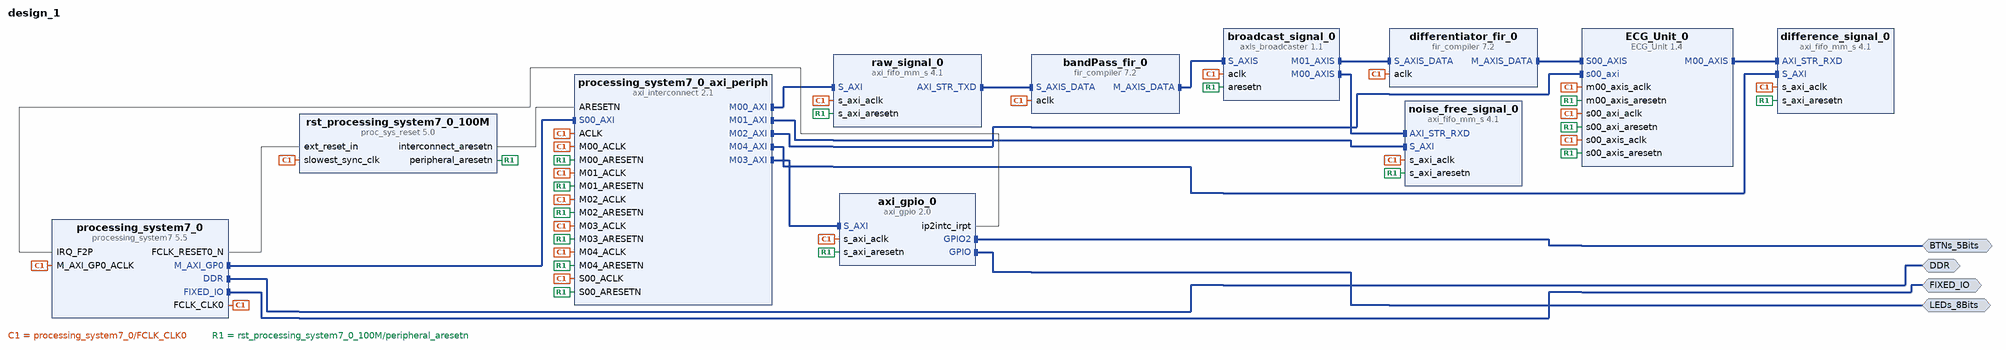
[diagram p0: block diagram of the top level]
# Vivado block design design_1, Vivado 2014.4
create_bd_design design_1

create_bd_intf_port -mode Master -vlnv xilinx.com:interface:gpio_rtl:1.0 BTNs_5Bits
create_bd_intf_port -mode Master -vlnv xilinx.com:interface:ddrx_rtl:1.0 DDR
create_bd_intf_port -mode Master -vlnv xilinx.com:display_processing_system7:fixedio_rtl:1.0 FIXED_IO
create_bd_intf_port -mode Master -vlnv xilinx.com:interface:gpio_rtl:1.0 LEDs_8Bits

create_bd_cell -type ip -vlnv xilinx.com:ip:axi_gpio:2.0 axi_gpio_0
set_property -dict [list \
  CONFIG.C_INTERRUPT_PRESENT 1 \
  CONFIG.USE_BOARD_FLOW true \
  CONFIG.GPIO_BOARD_INTERFACE LEDs_8Bits \
  CONFIG.GPIO2_BOARD_INTERFACE BTNs_5Bits \
] [get_bd_cells axi_gpio_0]
create_bd_cell -type ip -vlnv xilinx.com:ip:fir_compiler:7.2 bandPass_fir_0
set_property -dict [list \
  CONFIG.CoefficientSource COE_File \
  CONFIG.Coefficient_File ../../../../../../../src/ip_repo/ECG_Unit/coe/real_16_PB_1_40.coe \
  CONFIG.RateSpecification Frequency_Specification \
  CONFIG.Sample_Frequency 0.0005 \
  CONFIG.Clock_Frequency 50 \
  CONFIG.Quantization Quantize_Only \
  CONFIG.BestPrecision true \
  CONFIG.Coefficient_Structure Symmetric \
  CONFIG.Data_Sign Signed \
  CONFIG.Data_Width 32 \
  CONFIG.Data_Fractional_Bits 21 \
  CONFIG.Output_Rounding_Mode Truncate_LSBs \
  CONFIG.Output_Width 32 \
  CONFIG.DATA_Has_TLAST Packet_Framing \
  CONFIG.M_DATA_Has_TREADY true \
] [get_bd_cells bandPass_fir_0]
create_bd_cell -type ip -vlnv xilinx.com:ip:axis_broadcaster:1.1 broadcast_signal_0
create_bd_cell -type ip -vlnv xilinx.com:ip:axi_fifo_mm_s:4.1 difference_signal_0
set_property -dict {CONFIG.C_USE_RX_CUT_THROUGH false CONFIG.C_USE_TX_DATA 0} [get_bd_cells difference_signal_0]
create_bd_cell -type ip -vlnv xilinx.com:ip:fir_compiler:7.2 differentiator_fir_0
set_property -dict [list \
  CONFIG.CoefficientSource COE_File \
  CONFIG.Coefficient_File ../../../../../../../src/ip_repo/ECG_Unit/coe/diff_05_45.coe \
  CONFIG.Sample_Frequency 0.0005 \
  CONFIG.Clock_Frequency 50 \
  CONFIG.Quantization Quantize_Only \
  CONFIG.BestPrecision true \
  CONFIG.Data_Sign Signed \
  CONFIG.Data_Width 32 \
  CONFIG.Data_Fractional_Bits 16 \
  CONFIG.Output_Rounding_Mode Truncate_LSBs \
  CONFIG.Output_Width 32 \
  CONFIG.DATA_Has_TLAST Packet_Framing \
  CONFIG.M_DATA_Has_TREADY true \
] [get_bd_cells differentiator_fir_0]
create_bd_cell -type ip -vlnv xilinx.com:ip:axi_fifo_mm_s:4.1 noise_free_signal_0
set_property -dict {CONFIG.C_USE_RX_CUT_THROUGH false CONFIG.C_USE_TX_DATA 0} [get_bd_cells noise_free_signal_0]
create_bd_cell -type ip -vlnv xilinx.com:ip:processing_system7:5.5 processing_system7_0
set_property -dict [list \
  CONFIG.PCW_FPGA0_PERIPHERAL_FREQMHZ 50 \
  CONFIG.PCW_FPGA1_PERIPHERAL_FREQMHZ 0.25 \
  CONFIG.PCW_USE_AXI_FABRIC_IDLE 1 \
  CONFIG.PCW_USE_FABRIC_INTERRUPT 1 \
  CONFIG.PCW_EN_CLK1_PORT 1 \
  CONFIG.PCW_P2F_UART0_INTR 1 \
  CONFIG.PCW_P2F_UART1_INTR 1 \
  CONFIG.PCW_IRQ_F2P_INTR 1 \
  CONFIG.PCW_CORE0_FIQ_INTR 1 \
  CONFIG.PCW_CORE0_IRQ_INTR 1 \
  CONFIG.PCW_CORE1_FIQ_INTR 1 \
  CONFIG.PCW_CORE1_IRQ_INTR 1 \
  CONFIG.PCW_ENET0_PERIPHERAL_ENABLE 0 \
  CONFIG.PCW_SD0_PERIPHERAL_ENABLE 0 \
  CONFIG.PCW_UART0_PERIPHERAL_ENABLE 1 \
  CONFIG.PCW_UART0_UART0_IO {MIO 10 .. 11} \
  CONFIG.PCW_USB0_PERIPHERAL_ENABLE 0 \
  CONFIG.preset {ZedBoard*} \
] [get_bd_cells processing_system7_0]
# 7 more settings of processing_system7_0 are not shown: defaults, MIO pin electricals, DDR timing, and values the tool derives
create_bd_cell -type ip -vlnv xilinx.com:ip:axi_interconnect:2.1 processing_system7_0_axi_periph
set_property -dict {CONFIG.NUM_MI 5 CONFIG.ENABLE_ADVANCED_OPTIONS 0} [get_bd_cells processing_system7_0_axi_periph]
create_bd_cell -type ip -vlnv xilinx.com:ip:axi_fifo_mm_s:4.1 raw_signal_0
set_property -dict {CONFIG.C_HAS_AXIS_TDEST false CONFIG.C_USE_RX_DATA 0 CONFIG.C_USE_TX_CTRL 0} [get_bd_cells raw_signal_0]
create_bd_cell -type ip -vlnv xilinx.com:ip:proc_sys_reset:5.0 rst_processing_system7_0_100M
create_bd_cell -type ip -vlnv xilinx.com:user:ECG_Unit:1.4 ECG_Unit_0
set_property -dict [list \
  CONFIG.C_M00_AXIS_START_COUNT 1 \
  CONFIG.C_S_READ_f_FIFO_START_COUNT 1 \
  CONFIG.C_M_FIFO_DEPTH 256 \
  CONFIG.C_S_FIFO_DEPTH 256 \
] [get_bd_cells ECG_Unit_0]

# ---- connections ----

connect_bd_intf_net [get_bd_intf_pins ECG_Unit_0/M00_AXIS] [get_bd_intf_pins difference_signal_0/AXI_STR_RXD]
connect_bd_intf_net -intf_net axi_fifo_mm_s_0_AXI_STR_TXD [get_bd_intf_pins bandPass_fir_0/S_AXIS_DATA] [get_bd_intf_pins raw_signal_0/AXI_STR_TXD]
connect_bd_intf_net -intf_net axis_broadcaster_0_M00_AXIS [get_bd_intf_pins broadcast_signal_0/M00_AXIS] [get_bd_intf_pins noise_free_signal_0/AXI_STR_RXD]
connect_bd_intf_net -intf_net axis_broadcaster_0_M01_AXIS [get_bd_intf_pins broadcast_signal_0/M01_AXIS] [get_bd_intf_pins differentiator_fir_0/S_AXIS_DATA]
connect_bd_intf_net -intf_net fir_compiler_0_M_AXIS_DATA [get_bd_intf_pins bandPass_fir_0/M_AXIS_DATA] [get_bd_intf_pins broadcast_signal_0/S_AXIS]
connect_bd_intf_net -intf_net fir_compiler_0_M_AXIS_DATA1 [get_bd_intf_pins ECG_Unit_0/S00_AXIS] [get_bd_intf_pins differentiator_fir_0/M_AXIS_DATA]
connect_bd_intf_net [get_bd_intf_pins processing_system7_0/M_AXI_GP0] [get_bd_intf_pins processing_system7_0_axi_periph/S00_AXI]
connect_bd_intf_net [get_bd_intf_pins processing_system7_0_axi_periph/M00_AXI] [get_bd_intf_pins raw_signal_0/S_AXI]
connect_bd_intf_net [get_bd_intf_pins noise_free_signal_0/S_AXI] [get_bd_intf_pins processing_system7_0_axi_periph/M01_AXI]
connect_bd_intf_net [get_bd_intf_pins ECG_Unit_0/s00_axi] [get_bd_intf_pins processing_system7_0_axi_periph/M02_AXI]
connect_bd_intf_net [get_bd_intf_pins axi_gpio_0/S_AXI] [get_bd_intf_pins processing_system7_0_axi_periph/M03_AXI]
connect_bd_intf_net [get_bd_intf_pins difference_signal_0/S_AXI] [get_bd_intf_pins processing_system7_0_axi_periph/M04_AXI]
connect_bd_intf_net [get_bd_intf_ports BTNs_5Bits] [get_bd_intf_pins axi_gpio_0/GPIO2]
connect_bd_intf_net [get_bd_intf_ports DDR] [get_bd_intf_pins processing_system7_0/DDR]
connect_bd_intf_net [get_bd_intf_ports FIXED_IO] [get_bd_intf_pins processing_system7_0/FIXED_IO]
connect_bd_intf_net [get_bd_intf_ports LEDs_8Bits] [get_bd_intf_pins axi_gpio_0/GPIO]
connect_bd_net [get_bd_pins axi_gpio_0/ip2intc_irpt] [get_bd_pins processing_system7_0/IRQ_F2P]
connect_bd_net [get_bd_pins processing_system7_0/FCLK_CLK0] \
  [get_bd_pins axi_gpio_0/s_axi_aclk] [get_bd_pins bandPass_fir_0/aclk] [get_bd_pins broadcast_signal_0/aclk] \
  [get_bd_pins difference_signal_0/s_axi_aclk] [get_bd_pins differentiator_fir_0/aclk] \
  [get_bd_pins noise_free_signal_0/s_axi_aclk] [get_bd_pins processing_system7_0/M_AXI_GP0_ACLK] \
  [get_bd_pins raw_signal_0/s_axi_aclk] [get_bd_pins rst_processing_system7_0_100M/slowest_sync_clk] \
  [get_bd_pins processing_system7_0_axi_periph/ACLK] [get_bd_pins processing_system7_0_axi_periph/M00_ACLK] \
  [get_bd_pins processing_system7_0_axi_periph/M01_ACLK] [get_bd_pins processing_system7_0_axi_periph/M02_ACLK] \
  [get_bd_pins processing_system7_0_axi_periph/M03_ACLK] [get_bd_pins processing_system7_0_axi_periph/M04_ACLK] \
  [get_bd_pins processing_system7_0_axi_periph/S00_ACLK] [get_bd_pins ECG_Unit_0/s00_axi_aclk] \
  [get_bd_pins ECG_Unit_0/s00_axis_aclk] [get_bd_pins ECG_Unit_0/m00_axis_aclk]
connect_bd_net [get_bd_pins processing_system7_0/FCLK_RESET0_N] [get_bd_pins rst_processing_system7_0_100M/ext_reset_in]
connect_bd_net [get_bd_pins rst_processing_system7_0_100M/interconnect_aresetn] [get_bd_pins processing_system7_0_axi_periph/ARESETN]
connect_bd_net [get_bd_pins rst_processing_system7_0_100M/peripheral_aresetn] \
  [get_bd_pins axi_gpio_0/s_axi_aresetn] [get_bd_pins broadcast_signal_0/aresetn] \
  [get_bd_pins difference_signal_0/s_axi_aresetn] [get_bd_pins noise_free_signal_0/s_axi_aresetn] \
  [get_bd_pins raw_signal_0/s_axi_aresetn] [get_bd_pins processing_system7_0_axi_periph/M00_ARESETN] \
  [get_bd_pins processing_system7_0_axi_periph/M01_ARESETN] [get_bd_pins processing_system7_0_axi_periph/M02_ARESETN] \
  [get_bd_pins processing_system7_0_axi_periph/M03_ARESETN] [get_bd_pins processing_system7_0_axi_periph/M04_ARESETN] \
  [get_bd_pins processing_system7_0_axi_periph/S00_ARESETN] [get_bd_pins ECG_Unit_0/s00_axi_aresetn] \
  [get_bd_pins ECG_Unit_0/s00_axis_aresetn] [get_bd_pins ECG_Unit_0/m00_axis_aresetn]

# ---- address map ----
assign_bd_address -offset 0x41200000 -range 64K -target_address_space [get_bd_addr_spaces processing_system7_0/Data] [get_bd_addr_segs axi_gpio_0/S_AXI/Reg]
assign_bd_address -offset 0x43C00000 -range 64K -target_address_space [get_bd_addr_spaces processing_system7_0/Data] [get_bd_addr_segs raw_signal_0/S_AXI/Mem0]
assign_bd_address -offset 0x43C10000 -range 64K -target_address_space [get_bd_addr_spaces processing_system7_0/Data] [get_bd_addr_segs noise_free_signal_0/S_AXI/Mem0]
assign_bd_address -offset 0x43C20000 -range 64K -target_address_space [get_bd_addr_spaces processing_system7_0/Data] [get_bd_addr_segs ECG_Unit_0/s00_axi/reg0]
assign_bd_address -offset 0x43C30000 -range 64K -target_address_space [get_bd_addr_spaces processing_system7_0/Data] [get_bd_addr_segs difference_signal_0/S_AXI/Mem0]

validate_bd_design
save_bd_design
